# Altium schematic sheet MicroController.SchDoc
size A3; DrawnBy: Safak Ozdemir; Revision: V1.0; SheetNumber: 3; SheetTotal: 3
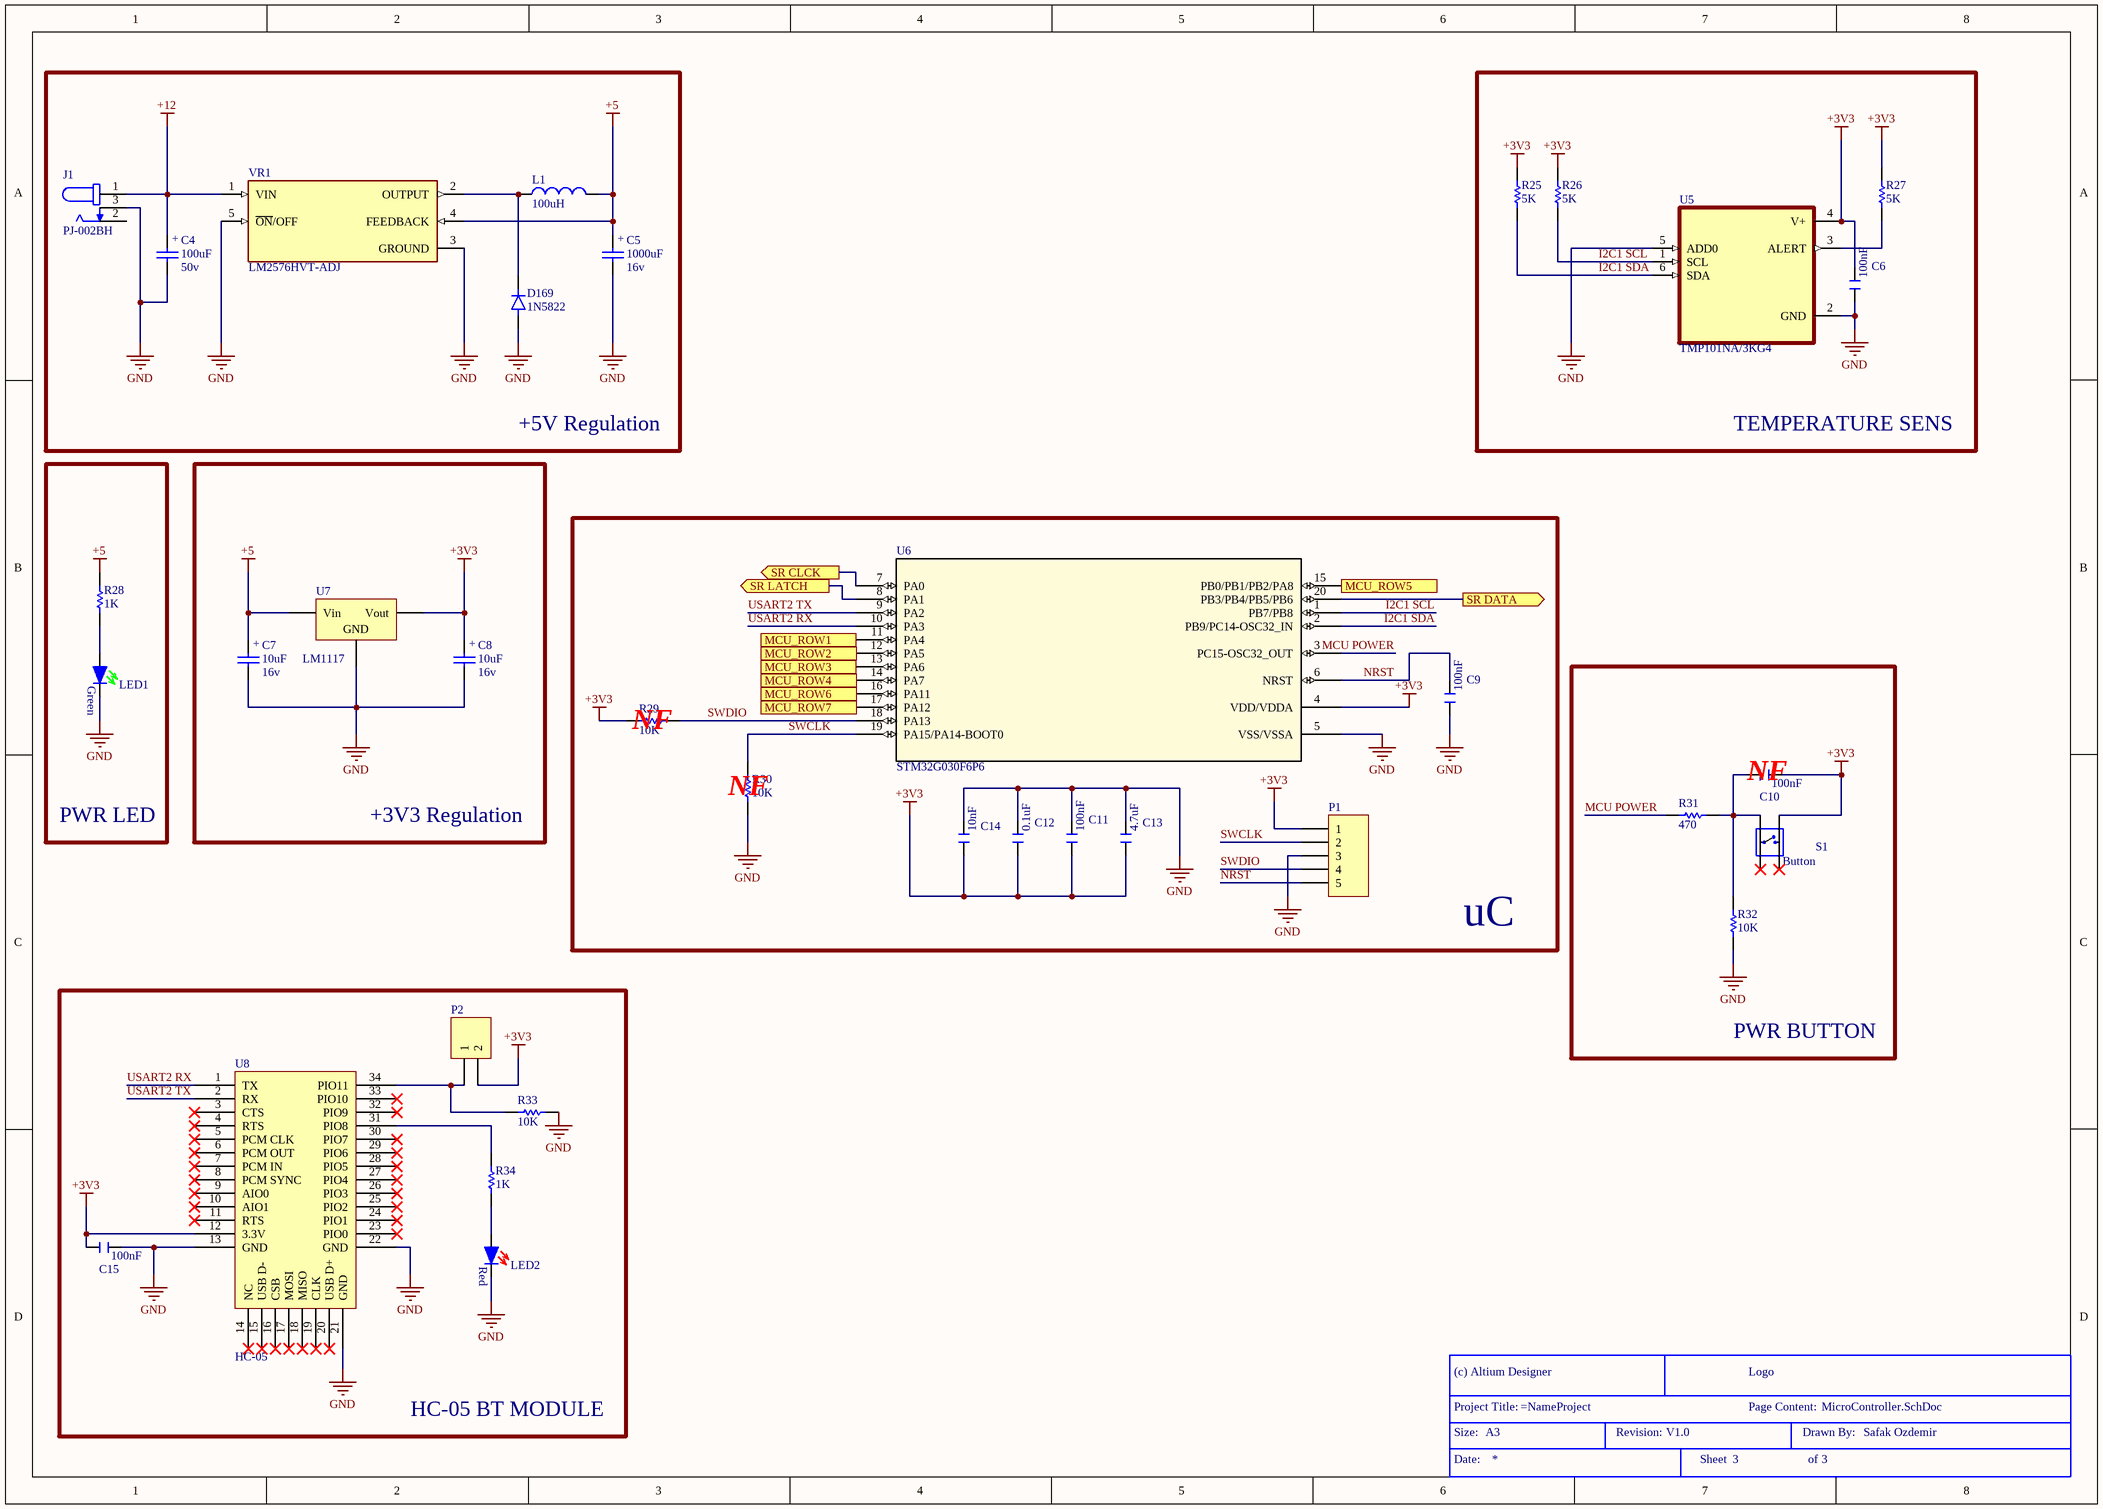
[diagram p0: MicroController.SchDoc]

## Parts
*  Size: A3  (hidden comment: Title Block)  (graphical)
C4  Volte: 50v  [MY_CLV_0810]  (hidden comment: 100uF)
C5  Volte: 16v  [MY_CLV_0810]  (hidden comment: 1000uF)
C6  CAP_0805_100nF  [CAP_0805]  (value not drawn)
C7  Volte: 16v  [MY_SMC_B]  (hidden comment: 10uF)
C8  Volte: 16v  [MY_SMC_B]  (hidden comment: 10uF)
C9  CAP_0805_100nF  [CAP_0805]  (value not drawn)
C10  CAP_0805_100nF  [CAP_0805]  (value not drawn)
C11  CAP_0805_100nF  [CAP_0805]  (value not drawn)
C12  CAP_0805_0.1uF  [CAP_0805]  (value not drawn)
C13  CAP_0805_4.7uF  [CAP_0805]  (value not drawn)
C14  CAP_0805_10nF  [CAP_0805]  (value not drawn)
C15  CAP_0805_100nF  [CAP_0805]  (value not drawn)
D169  1N5822  [DIOAD1990W125L900D530]
J1  PJ-002BH  [CUI_PJ-002BH]
L1  100uH  [MY_DR125]
LED1  LED SMD 0805 GREEN  [LED_0805]  (value not drawn)
LED2  LED SMD 0805 RED  [LED_0805]  (value not drawn)
P1  Header 5  [My_1X05]  (value not drawn)
P2  Header 2  [My_1X02]  (value not drawn)
R25  5K  [MY_0805]
R26  5K  [MY_0805]
R27  5K  [MY_0805]
R28  1K  [MY_0805]
R29  10K  [MY_0805]
R30  10K  [MY_0805]
R31  470  [MY_0805]
R32  10K  [MY_0805]
R33  10K  [MY_0805]
R34  1K  [MY_0805]
S1  6MM_BUTTON  [6MM_TACTILE_SWITCH]  (value not drawn)
U5  TMP101NA/3KG4  [SOT95P280X145-6N]
U6  STM32G030F6P6  [TSSOP20]
U7  LM1117  [MY_SOT223]
U8  HC-05  [HC-05]
VR1  LM2576HVT-ADJ  [TO170P1067X483X1651-5]

## Blocks framed on the sheet
+5V Regulation: C4 C5 D169 J1 L1 VR1
TEMPERATURE SENS: C6 R25-R27 U5
PWR LED: LED1 R28
+3V3 Regulation: C7 C8 U7
uC: C9 C11-C14 P1 R29 R30 U6
NF: C10 R31 R32 S1
HC-05 BT MODULE: C15 LED2 P2 R33 R34 U8

## Ports
MCU_ROW1 (out, see Main[2B], 7x24_Led_Matrix_Design[2B]), MCU_ROW2 (out, see Main[2B], 7x24_Led_Matrix_Design[2B]), MCU_ROW3 (out, see Main[2B], 7x24_Led_Matrix_Design[2B]), MCU_ROW4 (out, see Main[2B], 7x24_Led_Matrix_Design[2B]), MCU_ROW5 (out, see Main[2B], 7x24_Led_Matrix_Design[2B]), MCU_ROW6 (out, see Main[2B], 7x24_Led_Matrix_Design[2B]), MCU_ROW7 (out, see Main[2B], 7x24_Led_Matrix_Design[2B]), SR CLCK (out, see Main[2B], 7x24_Led_Matrix_Design[4A]), SR DATA (out, see Main[2B], 7x24_Led_Matrix_Design[4A]), SR LATCH (out, see Main[2B], 7x24_Led_Matrix_Design[4A])

## Nets
+3V3: C6.2 C8.+ C10.2 C11.1 C12.1 C13.1 C14.1 C15.1 P1.1 P2.2 R25.1 R26.1 R27.1 R29.1 S1.4 U5.4(V+) U6.4(VDD/VDDA) U7.2(Vout) U8.12(3.3V)
+5: C5.+ C7.+ L1.2 R28.1 U7.3(Vin) VR1.4(FEEDBACK)
+12: C4.+ J1.1 VR1.1(VIN)
GND: C4.- C5.- C6.1 C7.- C8.- C9.1 C11.2 C12.2 C13.2 C14.2 C15.2 D169.A J1.3 LED1.C LED2.C P1.3 R30.2 R32.2 R33.2 U5.2(GND) U5.5(ADD0) U6.5(VSS/VSSA) U7.1(GND) U8.13(GND) U8.21(GND) U8.22(GND) VR1.3(GROUND) VR1.5(~{ON}/OFF)
I2C1 SCL: R26.2 U5.1(SCL) U6.1(PB7/PB8)
I2C1 SDA: R25.2 U5.6(SDA) U6.2(PB9/PC14-OSC32_IN)
MCU POWER: R31.1 U6.3(PC15-OSC32_OUT)
MCU_ROW1: U6.11(PA4) ; port MCU_ROW1
MCU_ROW2: U6.12(PA5) ; port MCU_ROW2
MCU_ROW3: U6.13(PA6) ; port MCU_ROW3
MCU_ROW4: U6.14(PA7) ; port MCU_ROW4
MCU_ROW5: U6.15(PB0/PB1/PB2/PA8) ; port MCU_ROW5
MCU_ROW6: U6.16(PA11) ; port MCU_ROW6
MCU_ROW7: U6.17(PA12) ; port MCU_ROW7
NRST: C9.2 P1.5 U6.6(NRST)
SR CLCK: U6.7(PA0) ; port SR CLCK
SR DATA: U6.20(PB3/PB4/PB5/PB6) ; port SR DATA
SR LATCH: U6.8(PA1) ; port SR LATCH
SWCLK: P1.2 R30.1 U6.19(PA15/PA14-BOOT0)
SWDIO: P1.4 R29.2 U6.18(PA13)
USART2 RX: U6.10(PA3) U8.1(TX)
USART2 TX: U6.9(PA2) U8.2(RX)
NetC10_1: C10.1 R31.2 R32.1 S1.3
NetD169_C: D169.C(K) L1.1 VR1.2(OUTPUT)
NetLED1_A: LED1.A R28.2
NetLED2_A: LED2.A R34.2
NetP2_1: P2.1 R33.1 U8.34(PIO11)
NetR27_2: R27.2 U5.3(ALERT)
NetR34_1: R34.1 U8.31(PIO8)

Not connected (* = marked no-connect by the designer): J1 2; S1 1* 2*; U8 3(CTS)* 4(RTS)* 5(PCM_CLK)* 6(PCM_OUT)* 7(PCM_IN)* 8(PCM_SYNC)* 9(AIO0)* 10(AIO1)* 11(RTS)* 14(NC)* 15(USB_D-)* 16(CSB)* 17(MOSI)* 18(MISO)* 19(CLK)* 20(USB_D+)* 23(PIO0)* 24(PIO1)* 25(PIO2)* 26(PIO3)* 27(PIO4)* 28(PIO5)* 29(PIO6)* 30(PIO7)* 32(PIO9)* 33(PIO10)*

## Notes on the sheet
- (near R29) NF
- (near R30) NF
- PWR BUTTON
- (in symbol 6MM_BUTTON) Button
- (in symbol CAP_0805_0.1uF) 0.1uF
- (in symbol CAP_0805_4.7uF) 4.7uF
- (in symbol CAP_0805_10nF) 10nF
- (in symbol CAP_0805_100nF) 100nF
- (in symbol LED_0805_GREEN) Green
- (in symbol LED_0805_RED) Red
- (in symbol Title Block) (c) Altium Designer; Logo; Project Title:; Page Content:; Size:; Revision:; Drawn By:; Date:; Sheet; of

## Library data of the parts
C4 C5 C7 C8 = Cap Pol: Polar capacitor; ASiD Part Number: C-AS
  C4: Value: 100uF
  C5: Value: 1000uF
  C7 C8: Value: 10uF
C6 C9-C11 C15 = CAP_0805_100nF: 0805 100nF 16VDC ±10% X7R; Voltage Rating: 16V; Tolerance: %10; Package Size: 0805; Dieclectric: X7R; Manufacturer: https://www.ozdisan.com/Product/Detail/748339/CC0805KRX7R7BB104
C12 = CAP_0805_0.1uF: 0805 0.1uF 16VDC ±10% X7R; Voltage Rating: 16V; Tolerance: %10; Package Size: 0805; Dieclectric: X7R; Manufacturer: https://www.ozdisan.com/Product/Detail/748339/CC0805KRX7R7BB104
C13 = CAP_0805_4.7uF: 0805 4.7uF 16VDC ±10% X7R; Voltage Rating: 16V; Tolerance: %10; Package Size: 0805; Dieclectric: X7R; Manufacturer: https://www.ozdisan.com/Product/Detail/748339/CC0805KRX7R7BB104
C14 = CAP_0805_10nF: 0805 10nF 16VDC ±10% X7R; Voltage Rating: 16V; Tolerance: %10; Package Size: 0805; Dieclectric: X7R; Manufacturer: https://www.ozdisan.com/Product/Detail/748339/CC0805KRX7R7BB104
D169 = 1N5822: Diode Schottky 40 V 3A Through Hole DO-201AD; MF: Micro Commercial; Package: DO-201AD-201 CDIL; Check_prices: https://www.snapeda.com/parts/1N5822/Micro+Commercial/view-part/?ref=eda; Availability: In Stock; MP: 1N5822; Value: *; Purchase-URL: https://pricing.snapeda.com/search/part/1N5822/?ref=eda; Price: None; SnapEDA_Link: https://www.snapeda.com/parts/1N5822/Micro+Commercial/view-part/?ref=snap
J1 = PJ-002BH: 2.5 x 6.5 mm, 5.0 A, Horizontal, Through Hole, Dc Power Jack Connector; MF: CUI Devices; CUI_purchase_URL: https://www.cuidevices.com/product/interconnect/connectors/dc-power-connectors/jacks/pj-002bh?utm_source=snapeda.com&utm_medium=referral&utm_campaign=snapedaBOM; Purchase-URL: https://pricing.snapeda.com/search/part/PJ-002BH/?ref=eda; MP: PJ-002BH; SnapEDA_Link: https://www.snapeda.com/parts/PJ-002BH/CUI+Devices/view-part/?ref=snap; Price: None; Package: None; Check_prices: https://www.snapeda.com/parts/PJ-002BH/CUI+Devices/view-part/?ref=eda; Value: *; Availability: In Stock
L1 = Inductor: ASiD Part Number: Inductor-AS; Current: 1A; Value: 100uH
LED1 = LED_0805_GREEN: LED SMD 0805 GREEN 550mcd; Voltage Rating: 2.6V; Current: 20mA; Manufacturer: https://www.ozdisan.com/led-ve-aydinlatma-cozumleri/led-komponentler/sinyal-ledler-tek-renkli/HL-PSC-2012U51GC/471651; Package Size: 0805
LED2 = LED_0805_RED: LED SMD 0805 RED 550mcd; Voltage Rating: 2.6V; Current: 20mA; Manufacturer: https://www.ozdisan.com/led-ve-aydinlatma-cozumleri/led-komponentler/sinyal-ledler-tek-renkli/HL-PSC-2012U51GC/471651; Package Size: 0805
P1 = Header 5: Header, 5-Pin; ASiD Part Number: Header 5-AS
P2 = Header 2: Header, 2-Pin; ASiD Part Number: Header 2-AS
R25-R34 = Res: Standard resistor; ASiD Part Number: Res-AS
  R25-R27: Value: 5K
  R28 R34: Value: 1K
  R29 R30 R32 R33: Value: 10K
  R31: Value: 470
S1 = 6MM_BUTTON: TACT 6x6MM 11MM 250gf SMD; Voltage Rating: 12V; Current: 50mA; Manufacturer: https://www.ozdisan.com/elektromekanik-komponentler/sivicler-ve-anahtarlar/tact-sivicler/DS1042-03-116-KKR-250-10/586990; Package Size: 6mm*6mm
U6 = STM32G030F6P6: No Description Available; Mfr_Name: STMicroelectronics; RefDes: RefDes; Type: Type
U7 = LM1117: Low Drop Voltage Reg; ASiD Part Number: LM1117-AS
VR1 = LM2576HVT-ADJ: SIMPLE SWITCHER&reg; 4V to 60V, 3A Low Component Count Step-Down Regulator 5-TO-220 -40 to 125; MF: Texas Instruments; SnapEDA_Link: https://www.snapeda.com/parts/LM2576HVT-ADJ/Texas+Instruments/view-part/?ref=snap; Package: TO-220-5 Texas Instruments; MP: LM2576HVT-ADJ; Check_prices: https://www.snapeda.com/parts/LM2576HVT-ADJ/Texas+Instruments/view-part/?ref=eda; Purchase-URL: https://pricing.snapeda.com/search/part/LM2576HVT-ADJ/?ref=eda; Price: None; Value: *; Availability: In Stock
U5 = TMP101NA/3KG4: Package: None; Price: None; Value: *; MP: TMP101NA/3KG4; Availability: Unavailable